# EasyEDA Pro project ProPrj_交通灯-升级款.epro

# Schematic Schematic2
Board Name: Board2; Create Date: 2025-10-13; Page Name: P1; Project Name: 交通灯-sell; Schematic Name: Schematic2; Update Date: 2025-10-13; Company: 嘉立创EDA; Page Size: A4; Version: V1.0
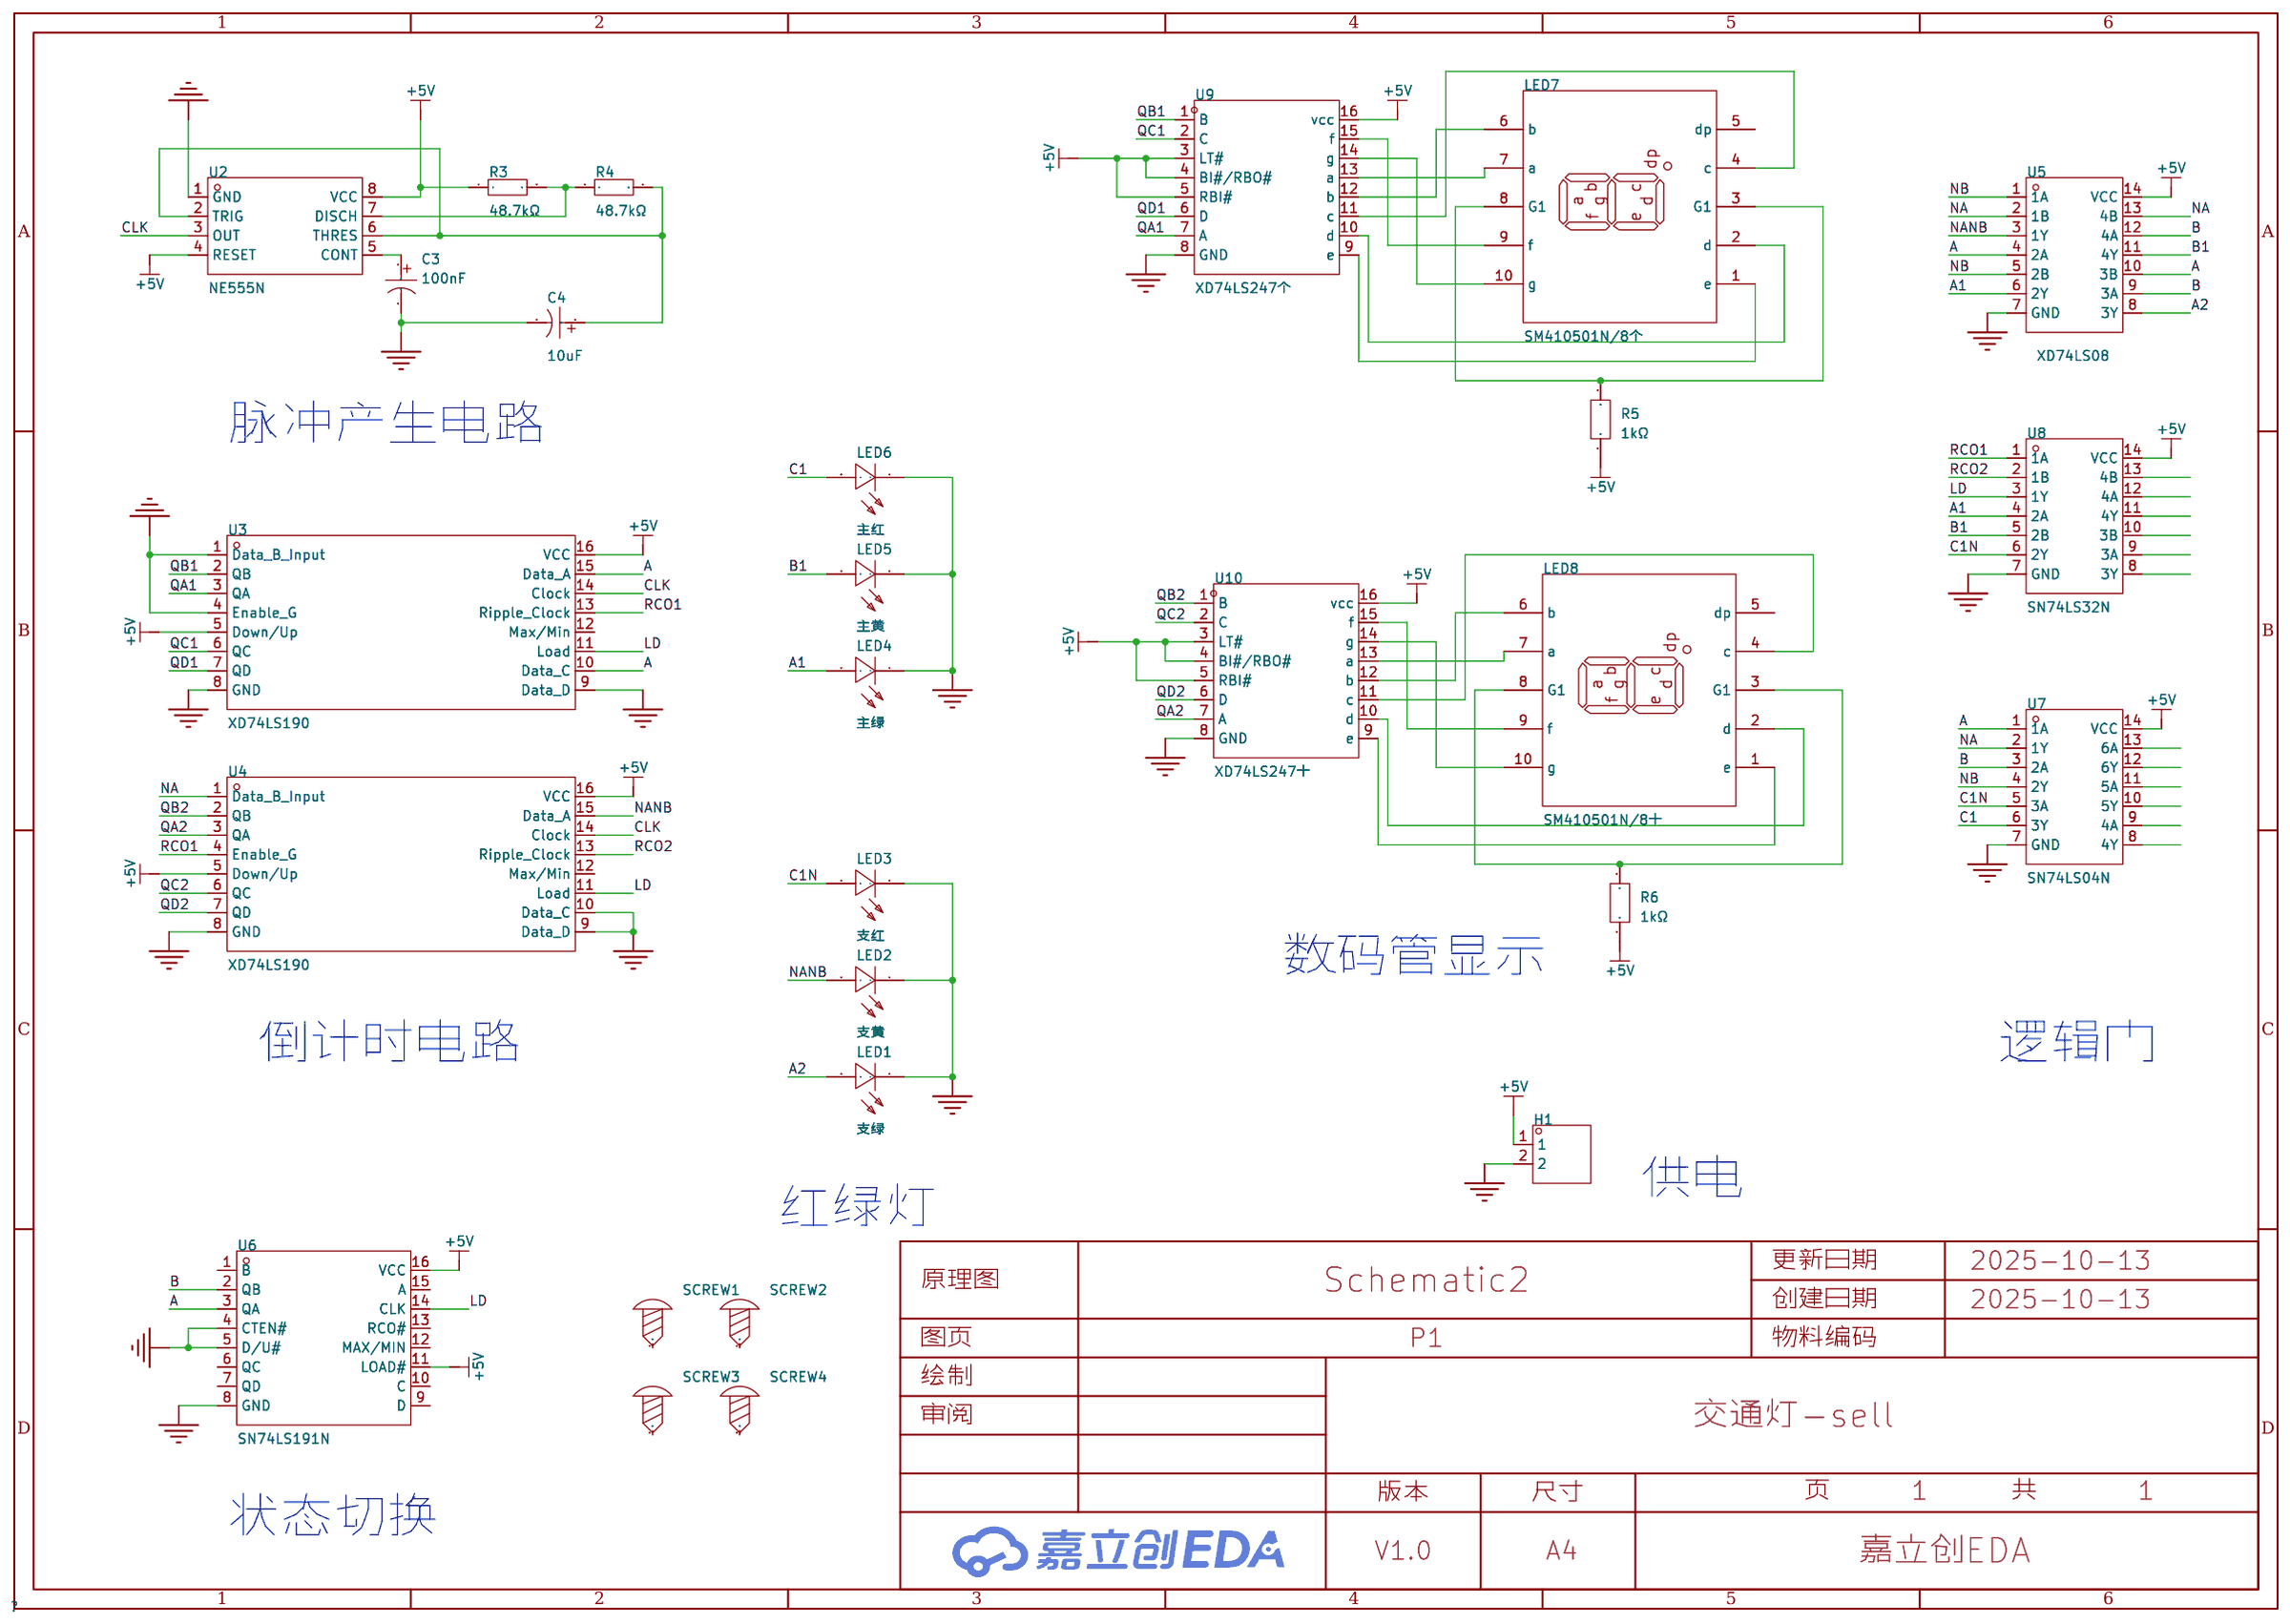
[diagram p0: schematic sheet]

## Parts
C3  100nF  [CAP-TH_BD4.0-P1.50-D0.8-FD]
C4  10uF  [CAP-TH_BD5.0-P2.00-D0.8-FD]
H1  -  [HDR-TH_2P-P2.54-V-M-1]
LED1  支绿  [LED-TH_BD3.9-P2.54-RD]
LED2  支黄  [LED-TH_BD3.9-P2.54-RD]
LED3  支红  [LED-TH_BD3.9-P2.54-RD]
LED4  主绿  [LED-TH_BD3.9-P2.54-RD]
LED5  主黄  [LED-TH_BD3.9-P2.54-RD]
LED6  主红  [LED-TH_BD3.9-P2.54-RD]
LED7  SM410501N/8个  [LED-SEG-TH_10P-L12.7-W19.0-P2.54-S15.24-BL]
LED8  SM410501N/8十  [LED-SEG-TH_10P-L12.7-W19.0-P2.54-S15.24-BL]
R3  48.7kΩ  [RES-TH_BD2.4-L6.3-P10.30-D0.6]
R4  48.7kΩ  [RES-TH_BD2.4-L6.3-P10.30-D0.6]
R5  1kΩ  [RES-TH_BD2.3-L6.5-P10.50-D0.5]
R6  1kΩ  [RES-TH_BD2.3-L6.5-P10.50-D0.5]
SCREW1  -  [M3螺丝]
SCREW2  -  [M3螺丝]
SCREW3  -  [M3螺丝]
SCREW4  -  [M3螺丝]
U2  NE555N  [DIP-8_L9.8-W6.6-P2.54-LS7.6-BL]
U3  XD74LS190  [DIP-16_L20.0-W6.4-P2.54-LS7.6-BL]
U4  XD74LS190  [DIP-16_L20.0-W6.4-P2.54-LS7.6-BL]
U5  XD74LS08  [DIP-14_L19.4-W6.4-P2.54-LS7.6-BL]
U6  SN74LS191N  [PDIP-16_L19.3-W6.4-P2.54-LS7.94-BL]
U7  SN74LS04N  [DIP-14_L19.1-W6.4-P2.54-LS7.6-BL]
U8  SN74LS32N  [DIP-14_L19.1-W6.4-P2.54-LS7.6-BL]
U9  XD74LS247个  [DIP-16_L19.3-W6.4-P2.54-LS7.6-BL]
U10  XD74LS247十  [DIP-16_L19.3-W6.4-P2.54-LS7.6-BL]

## Library data of the parts
C3 = KS104M050C07RR0VH2FP0: 容值:100nF;精度:±20%;额定电压:50V;纹波电流:1A@100kHz;等效串联电阻:-;; LCSC Part Name: 100nF ±20% 50V; Supplier Part: C45664; Manufacturer: CX(承兴); Supplier Footprint: 插件,D4xL7mm; JLCPCB Part Class: 扩展库; Datasheet: https://atta.szlcsc.com/upload/public/pdf/source/20211027/7B10195EF01EB9374BE8935690E3D906.pdf; Supplier: LCSC; Tolerance: ±20%; Rated Voltage: 50V; Ripple Current: 1A@100kHz; Lead Spacing: 1.5mm; φD: 4mm; L: 7mm; Lifetime @ Temp: 1000hrs@105℃; Operating Temperature: -40℃~+105℃
C4 = ERS1HM100D11OT: 容值:10uF;精度:±20%;额定电压:50V;; LCSC Part Name: 10uF ±20% 50V; Supplier Part: C106654; Manufacturer: AISHI(艾华集团); Supplier Footprint: 插件,D5xL11mm; JLCPCB Part Class: 扩展库; Datasheet: https://atta.szlcsc.com/upload/public/pdf/source/20191015/C438940_4B8E60A742BB0AE40DDEF87A5C89089D.pdf; Supplier: LCSC; Tolerance: ±20%; Rated Voltage: 50V; Lead Spacing: 2mm; φD: 5mm; L: 11mm; Lifetime @ Temp: 5000hrs@105℃
H1 = HDR-M_2.54_1x2P: Supplier Part: C124375; Supplier Footprint: 插件
LED1-LED6 = 204-10SUGD/S400-A4-L: Supplier Part: C778892; Manufacturer: EVERLIGHT(亿光); Supplier Footprint: 插件; JLCPCB Part Class: 扩展库; Supplier: LCSC
LED7 LED8 = SM410501N/8: 数码管位数:1位;发光颜色:红色;LED极性:共阳极;数字/字母大小(英寸):0.5;; LCSC Part Name: 1位0.5英寸红色数码管 共阳极; Supplier Part: C252200; Manufacturer: ARKLED(方舟); Supplier Footprint: 插件; JLCPCB Part Class: 扩展库; Datasheet: https://atta.szlcsc.com/upload/public/pdf/source/20180821/C252200_94AC65E7CE87F7CEF0892A0B7A50B302.pdf; Supplier: LCSC; Number of Characters: 1位; Luminous Color: 红色; LED Polarity: 共阳极; Digit/Alpha Size(inch): 0.5
R3 R4 = MFR-25FBF52-48K7: 电阻类型:金属膜电阻;阻值:48.7kΩ;精度:±1%;功率:250mW;温度系数:±100ppm/℃;; LCSC Part Name: 金属膜电阻 48.7kΩ ±1% 250mW; Supplier Part: C1365709; Manufacturer: YAGEO(国巨); Supplier Footprint: 插件,D2.4xL6.3mm; JLCPCB Part Class: 扩展库; Datasheet: https://atta.szlcsc.com/upload/public/pdf/source/20201029/C911418_CEA09B7112BCFF5AE38F343DDB8D42E7.pdf; Supplier: LCSC; Type: 金属膜电阻; Tolerance: ±1%; Power(Watts): 250mW; Temperature Coefficient: ±100ppm/℃; Operating Temperature Range: -55℃~+155℃
R5 R6 = MF1/4W-1KΩ±1%T52: 电阻类型:金属膜电阻;阻值:1kΩ;精度:±1%;功率:250mW;温度系数:±200ppm/℃;; LCSC Part Name: 金属膜电阻 1kΩ ±1% 250mW; Supplier Part: C713997; Manufacturer: 华星机电; Supplier Footprint: 插件,D2.3xL6.5mm; JLCPCB Part Class: 扩展库; Datasheet: https://atta.szlcsc.com/upload/public/pdf/source/20200731/C713882_AE8EB1102749D7E4FB4FB13DC898C429.pdf; Supplier: LCSC; Type: 金属膜电阻; Tolerance: ±1%; Power(Watts): 250mW; Temperature Coefficient: ±200ppm/℃
SCREW1-SCREW4 = M3螺丝: Supplier Footprint: 插件
U2 = NE555N_C398063: LCSC Part Name: 时基集成芯片; Supplier Part: C398063; Manufacturer: HGSEMI(华冠); Supplier Footprint: DIP-8; JLCPCB Part Class: 扩展库; Datasheet: https://atta.szlcsc.com/upload/public/pdf/source/20210507/C398063_2BAEB56D23EF029756B1D4DE6D68B235.pdf; Supplier: LCSC
U3 U4 = XD74LS190: LCSC Part Name: 计数器 IC; Supplier Part: C707104; Manufacturer: XINLUDA(信路达); Supplier Footprint: DIP-16; JLCPCB Part Class: 扩展库; Datasheet: https://atta.szlcsc.com/upload/public/pdf/source/20200724/C707104_542995D84A96E0879D87E5CA2CD6E235.pdf; Supplier: LCSC
U5 = XD74LS08: 逻辑类型:-;; Supplier Part: C521139; Manufacturer: XINLUDA(信路达); Supplier Footprint: DIP-14; JLCPCB Part Class: 扩展库; Datasheet: https://atta.szlcsc.com/upload/public/pdf/source/20200619/C521139_1A49B54134F5C67771B06657CA6D9AAF.pdf; Supplier: LCSC
U6 = SN74LS191N: 工作电压:4.75V~5.25V;元件数:1;触发沿:上升沿;计数速率:25MHz;; LCSC Part Name: 25MHz 4位二进制计数器; Supplier Part: C1523316; Manufacturer: TI(德州仪器); Supplier Footprint: PDIP-16; JLCPCB Part Class: 扩展库; Datasheet: https://www.ti.com/cn/lit/gpn/sn54ls191; Supplier: LCSC; Logic Type: 二进制计数器; Direction: 向上计数器；向下计数器; Supply Voltage: 4.75V~5.25V; Number of Elements: 1; Trigger Type: 上升沿; Timing mode: 同步; Count Rate: 25MHz; Operating Temperature: 0℃~+70℃
U7 = SN74LS04N(LX): 电源电压:2V~6V;供电电流(最大值):2uA;电路数:6;最大传播延迟(tpd):14ns@6V;; Supplier Part: C22374093; Manufacturer: LX(灵星芯微); Supplier Footprint: DIP-14; JLCPCB Part Class: 扩展库; Datasheet: https://atta.szlcsc.com/upload/public/pdf/source/20240402/834FB3A59B1B710673385084ADD2A13F.pdf; Supplier: LCSC; Supply Voltage(Single): 2V~6V; Supply Current (Max): 2uA; Number of Circuits: 6; Sink Current: 5.2mA; Source Current: 5.2mA; High level range (VIH): 1.5V~4.2V; Low level range (VIL): 500mV~1.8V; High level range (VOH): 1.9V~5.9V; Low level range (VOL): 100mV~260mV; Max Propagation Delay: 14ns@6V; Series: 74LS系列; Operating Temperature: -40℃~+125℃
U8 = SN74LS32N_C22466295: Supplier Part: C22466295; Manufacturer: LX(灵星芯微); Supplier Footprint: DIP-14; JLCPCB Part Class: 扩展库; Datasheet: https://atta.szlcsc.com/upload/public/pdf/source/20240614/E0F0D1A0EAE2126389B0ECE8583863BF.pdf; Supplier: LCSC
U9 U10 = XD74LS247: BCD 到 7 段解码器/驱动器; Supplier Part: C609771; Manufacturer: XINLUDA(信路达); Supplier Footprint: DIP-16; JLCPCB Part Class: 扩展库; Datasheet: https://atta.szlcsc.com/upload/public/pdf/source/20200619/C609772_90A4531F9A683613D8102D7E5440D56B.pdf; Supplier: LCSC

## Nets
+5V: H1.1 R3.1 R5.1 R6.1 U2.4(RESET) U2.8(VCC) U3.5(Down/Up) U3.16(VCC) U4.5(Down/Up) U4.16(VCC) U5.14(VCC) U6.11(LOAD#) U6.16(VCC) U7.14(VCC) U8.14(VCC) U9.3(LT#) U9.4(BI#/RBO#) U9.5(RBI#) U9.16(vcc) U10.3(LT#) U10.4(BI#/RBO#) U10.5(RBI#) U10.16(vcc)
GND: C3.2 C4.2 H1.2 LED1.1(-) LED2.1(-) LED3.1(-) LED4.1(-) LED5.1(-) LED6.1(-) U2.1(GND) U3.1(Data B Input) U3.4(Enable G) U3.8(GND) U3.9(Data D) U4.8(GND) U4.9(Data D) U4.10(Data C) U5.7(GND) U6.4(CTEN#) U6.5(D/U#) U6.8(GND) U7.7(GND) U8.7(GND) U9.8(GND) U10.8(GND)
A: U3.10(Data C) U3.15(Data A) U5.4(2A) U5.10(3B) U6.3(QA) U7.1(1A)
A1: LED4.2(+) U5.6(2Y) U8.4(2A)
A2: LED1.2(+) U5.8(3Y)
B: U5.9(3A) U5.12(4A) U6.2(QB) U7.3(2A)
B1: LED5.2(+) U5.11(4Y) U8.5(2B)
C1: LED6.2(+) U7.6(3Y)
C1N: LED3.2(+) U7.5(3A) U8.6(2Y)
CLK: U2.3(OUT) U3.14(Clock) U4.14(Clock)
LD: U3.11(Load) U4.11(Load) U6.14(CLK) U8.3(1Y)
NA: U4.1(Data B Input) U5.2(1B) U5.13(4B) U7.2(1Y)
NANB: LED2.2(+) U4.15(Data A) U5.3(1Y)
NB: U5.1(1A) U5.5(2B) U7.4(2Y)
QA1: U3.3(QA) U9.7(A)
QA2: U4.3(QA) U10.7(A)
QB1: U3.2(QB) U9.1(B)
QB2: U4.2(QB) U10.1(B)
QC1: U3.6(QC) U9.2(C)
QC2: U4.6(QC) U10.2(C)
QD1: U3.7(QD) U9.6(D)
QD2: U4.7(QD) U10.6(D)
RCO1: U3.13(Ripple Clock) U4.4(Enable G) U8.1(1A)
RCO2: U4.13(Ripple Clock) U8.2(1B)
$1N252: C4.1 R4.2 U2.2(TRIG) U2.6(THRES)
$1N730: R3.2 R4.1 U2.7(DISCH)
$1N740: C3.1 U2.5(CONT)
$1N6367: LED7.7(a) U9.13(a)
$1N6372: LED7.6(b) U9.12(b)
$1N6378: LED7.10(g) U9.14(g)
$1N6385: LED7.9(f) U9.15(f)
$1N6412: LED7.3(G1) LED7.8(G1) R5.2
$1N6533: LED7.4(c) U9.11(c)
$1N6544: LED7.1(e) U9.9(e)
$1N6553: LED7.2(d) U9.10(d)
$1N6791: LED8.7(a) U10.13(a)
$1N6794: LED8.6(b) U10.12(b)
$1N6798: LED8.10(g) U10.14(g)
$1N6802: LED8.9(f) U10.15(f)
$1N6806: LED8.3(G1) LED8.8(G1) R6.2
$1N6815: LED8.4(c) U10.11(c)
$1N6821: LED8.1(e) U10.9(e)
$1N6825: LED8.2(d) U10.10(d)

Not connected (* = marked no-connect by the designer): LED7 5(dp); LED8 5(dp); SCREW1 1; SCREW2 1; SCREW3 1; SCREW4 1; U3 12(Max/Min); U4 12(Max/Min); U6 1(B) 6(QC) 7(QD) 9(D) 10(C) 12(MAX/MIN) 13(RCO#) 15(A); U7 8(4Y) 9(4A) 10(5Y) 11(5A) 12(6Y) 13(6A); U8 8(3Y) 9(3A) 10(3B) 11(4Y) 12(4A) 13(4B)

## Notes on the sheet
- 脉冲产生电路
- 数码管显示
- 倒计时电路
- 逻辑门
- 供电
- 红绿灯
- 状态切换

# Board PCB3
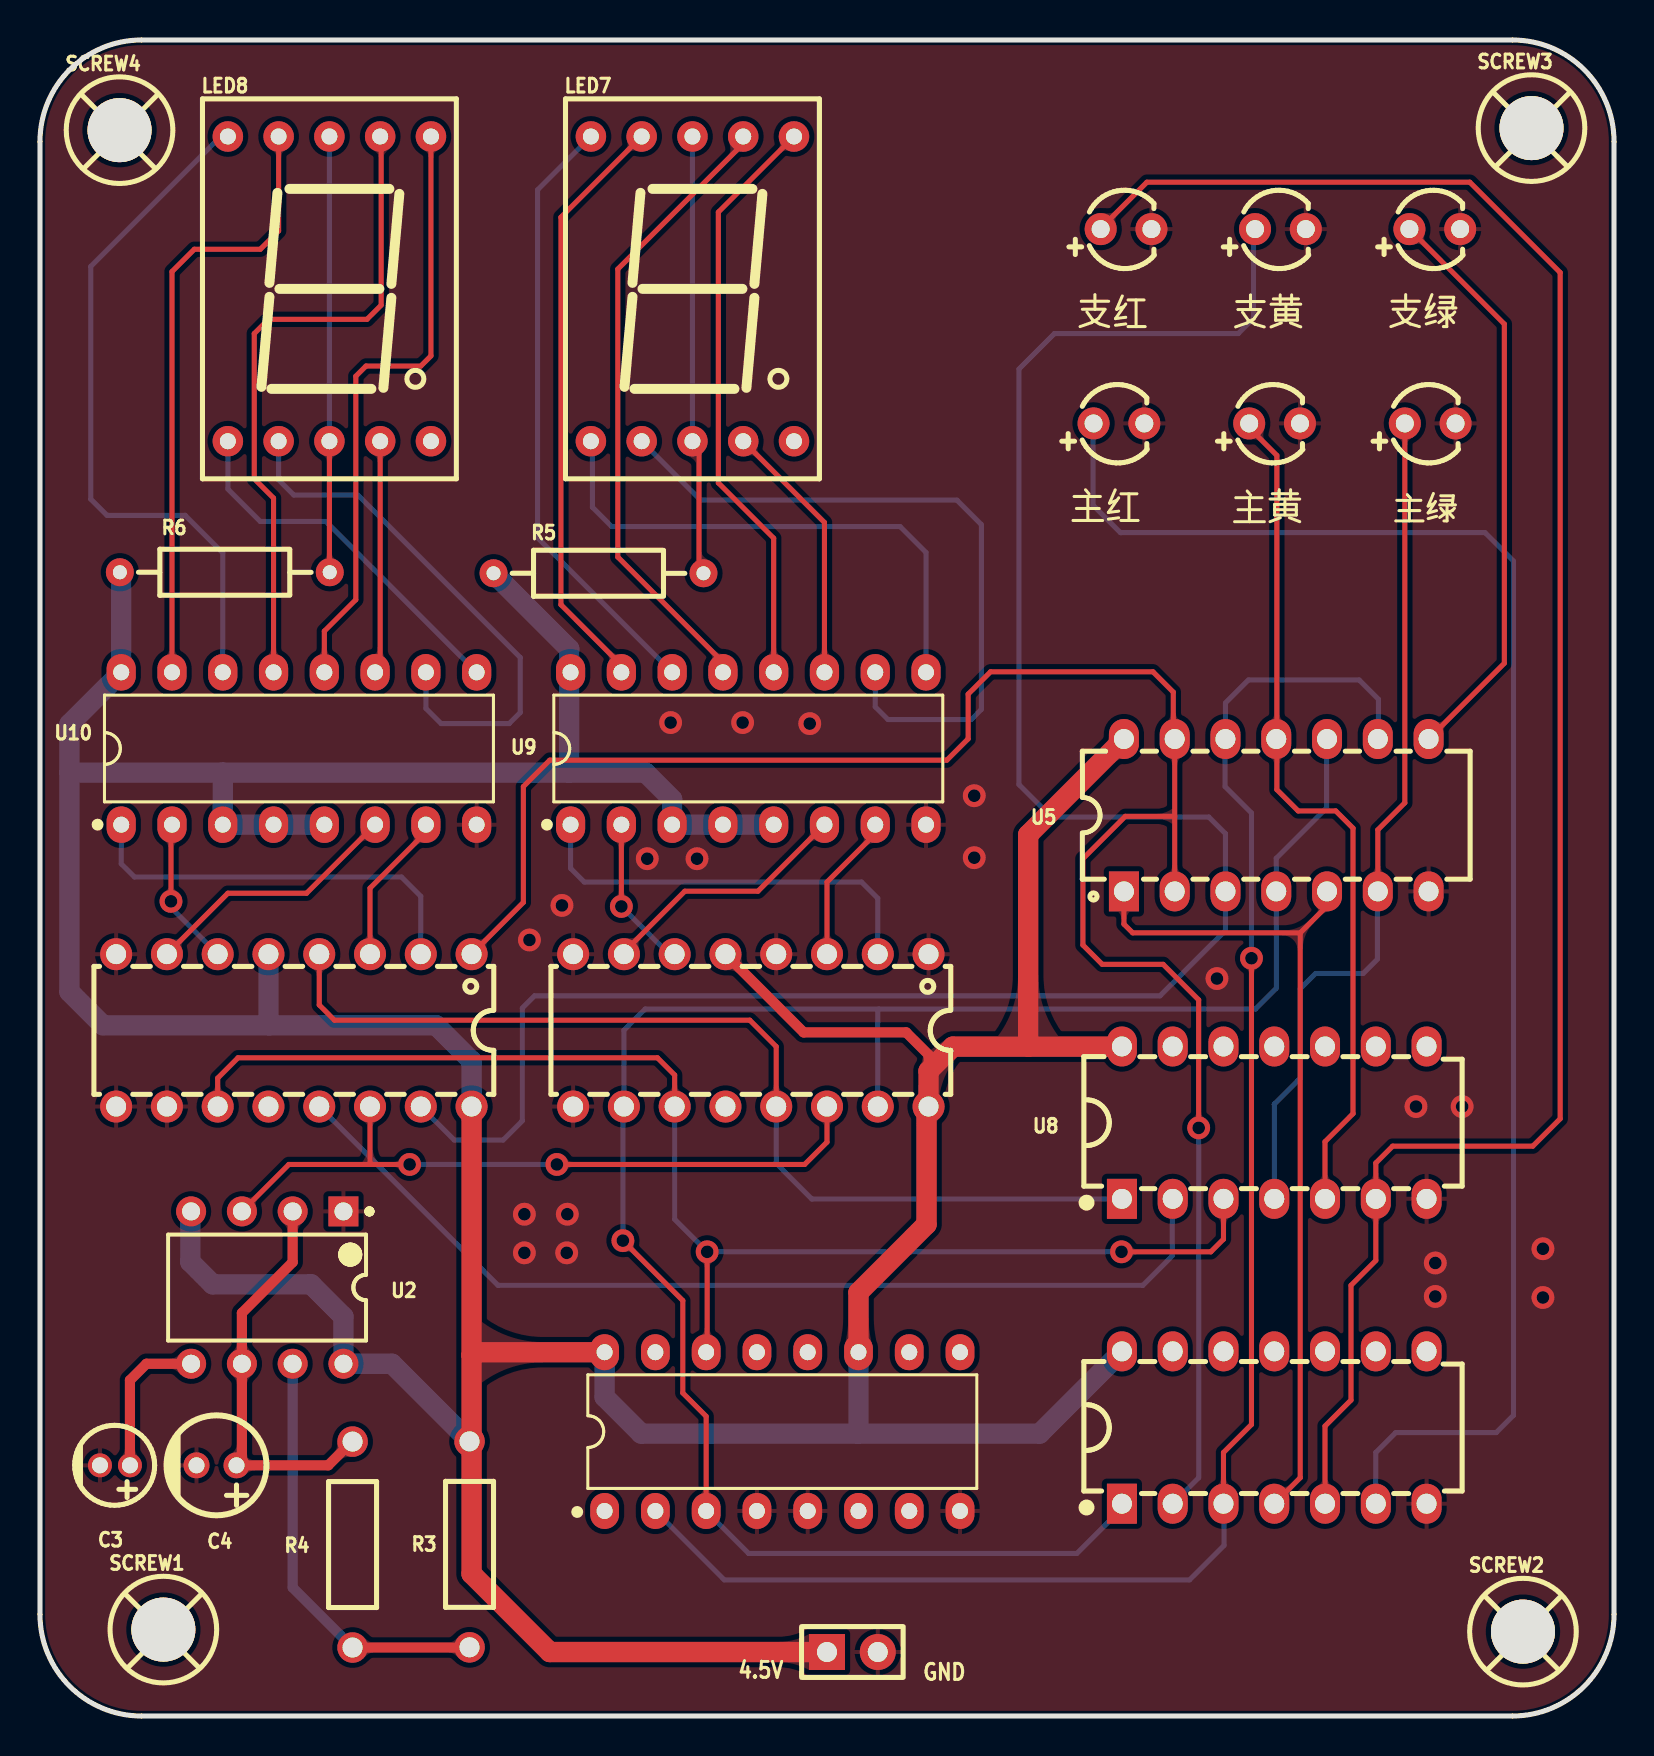
[diagram p1: board, top side]
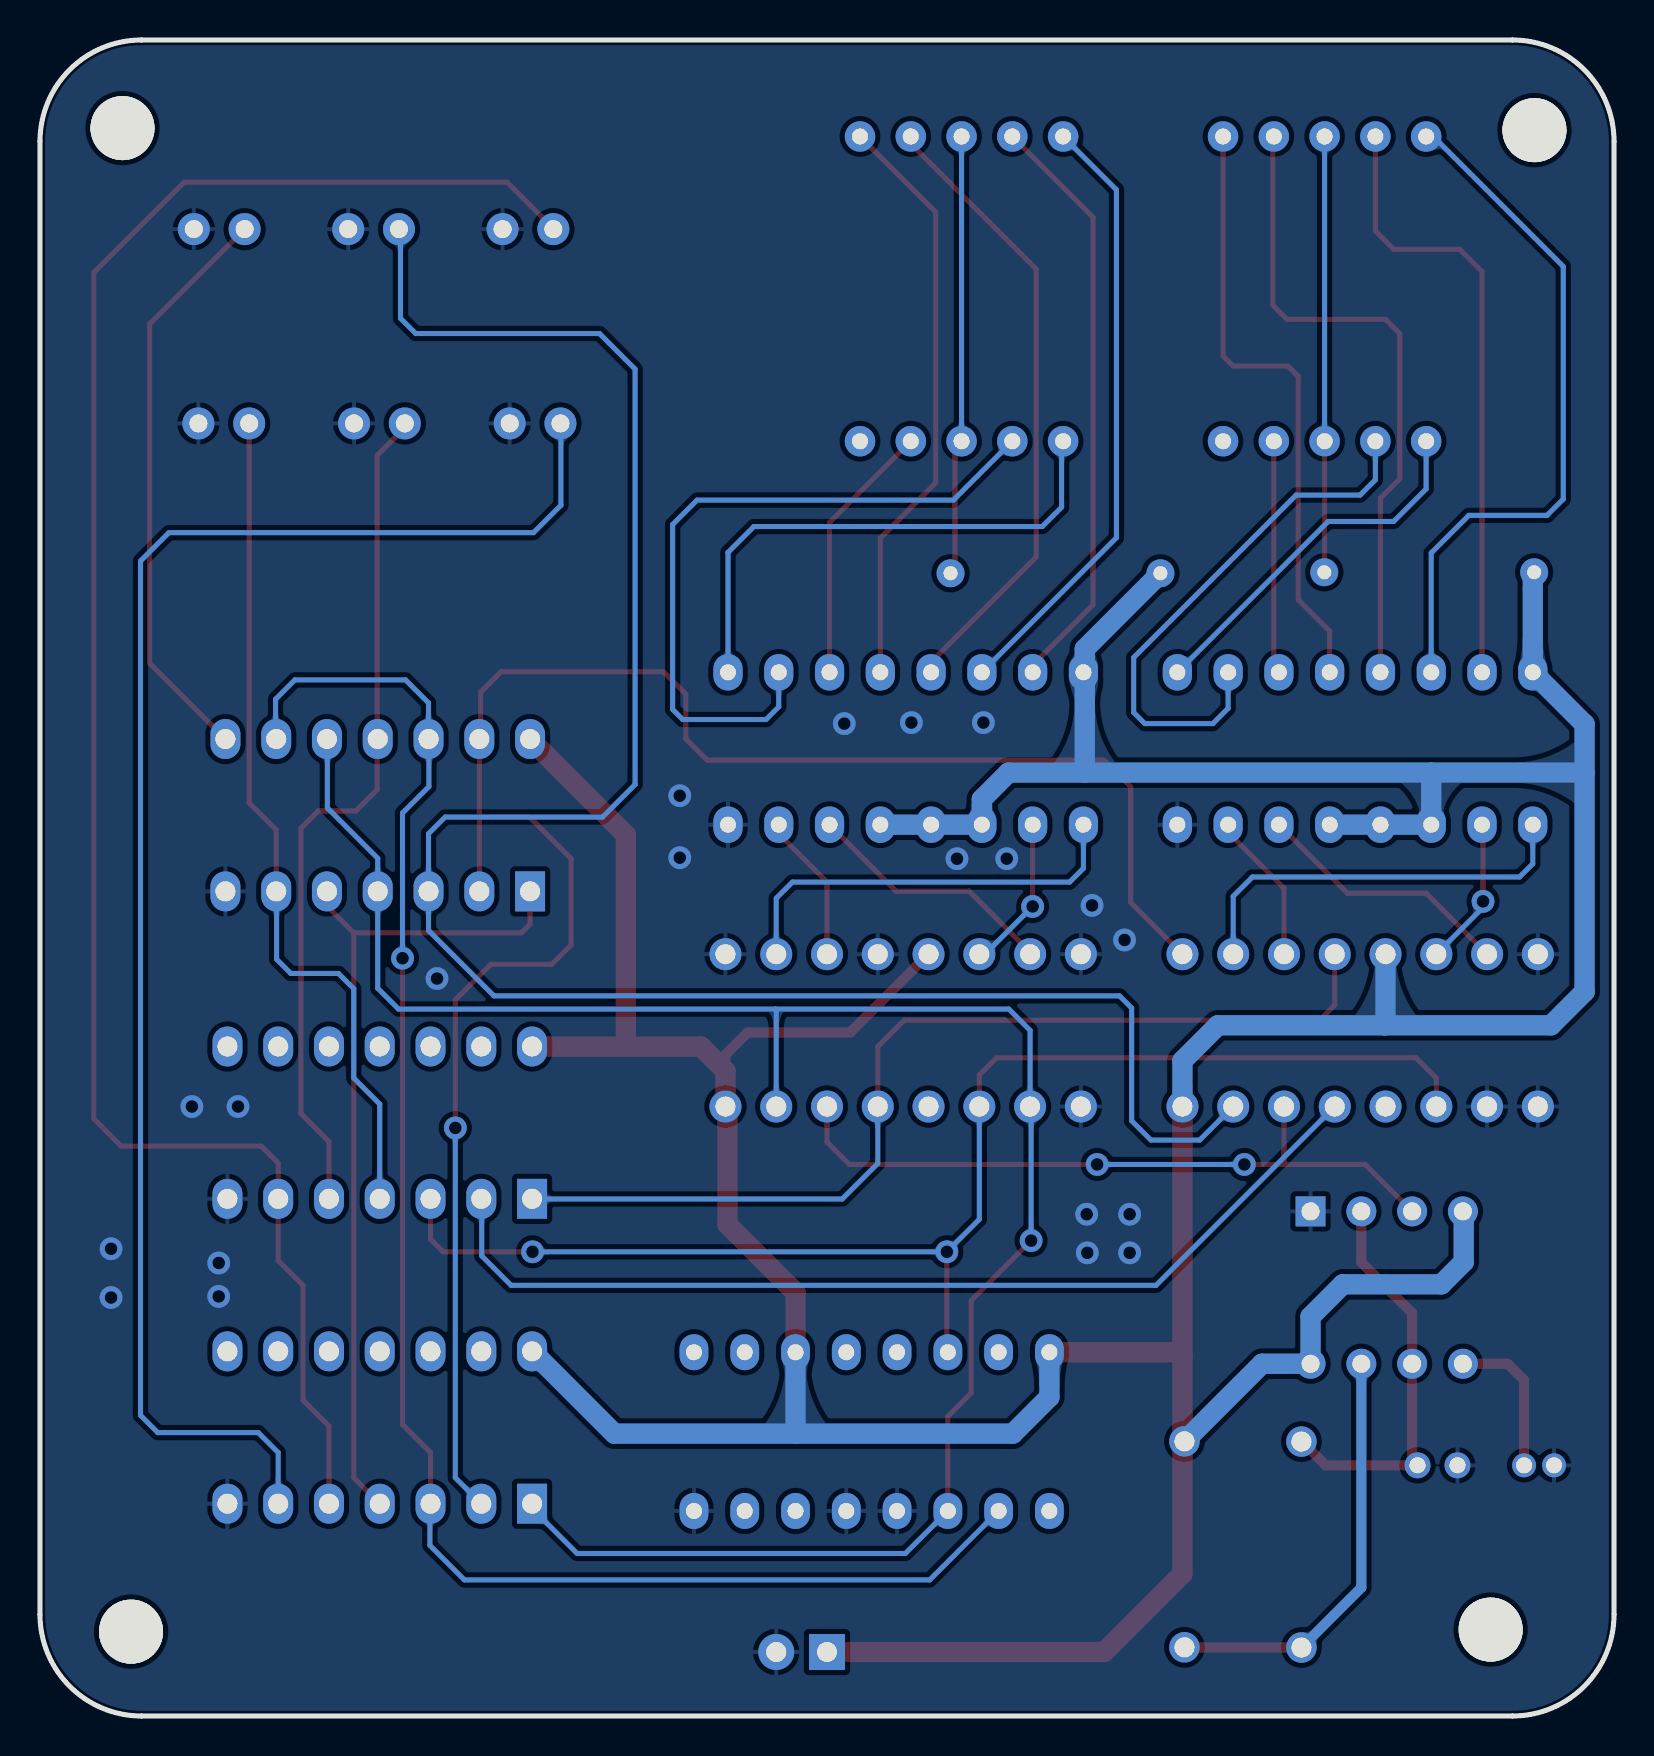
[diagram p2: board, bottom side, seen from below]

Outline 78.74 x 83.82 mm; copper layers: Top Layer, Bottom Layer. Coordinates in mm from the lower left corner of the outline.
Outline path: 0,78.74 0,5.08 arc(1.49,1.49) 5.08,0 73.66,0 arc(77.25,1.49) 78.74,5.08 78.74,78.74 arc(77.25,82.33) 73.66,83.82 5.08,83.82 arc(1.49,82.33) 0,78.74
Stack: Top Layer 0.035mm / Dielectric1 1.51mm FR4 er 4.5 / Bottom Layer 0.035mm

## Design rules (mm)
template: JLCPCB Capability(Two Layers Board)
spacing copperThickness1oz (default): track to track 0.102, other pairs 0.152 to 0.3
spacing copperThickness2oz: track to track 0.203, other pairs 0.152 to 0.3
track width copperThickness1oz (default): min 0.127, default 0.254, max 2.54
track width copperThickness2oz: min 0.203, default 0.254, max 2.54
differential pair differentialPair (default): width min 0.127, default 0.254, max 2.54; gap min 0.152, default 0.152
via viaSize (default): diameter min 0.5, default 0.61, max 10; hole min 0.3, default 0.305, max 6.3

## Placement (name value [footprint] x y rotation side)
C3  100nF  [CAP-TH_BD4.0-P1.50-D0.8-FD]  3.75 12.54 180 top
C4  10uF  [CAP-TH_BD5.0-P2.00-D0.8-FD]  8.83 12.54 180 top
H1  -  [HDR-TH_2P-P2.54-V-M-1]  40.64 3.2 0 top
LED1  支绿  [LED-TH_BD3.9-P2.54-RD]  69.77 74.36 180 top
LED2  支黄  [LED-TH_BD3.9-P2.54-RD]  62.05 74.36 180 top
LED3  支红  [LED-TH_BD3.9-P2.54-RD]  54.33 74.36 180 top
LED5  主黄  [LED-TH_BD3.9-P2.54-RD]  61.76 64.64 180 top
LED6  主红  [LED-TH_BD3.9-P2.54-RD]  53.97 64.64 180 top
LED7  SM410501N/8个  [LED-SEG-TH_10P-L12.7-W19.0-P2.54-S15.24-BL]  32.64 71.37 0 top
LED8  SM410501N/8十  [LED-SEG-TH_10P-L12.7-W19.0-P2.54-S15.24-BL]  14.48 71.37 0 top
R3  48.7kΩ  [RES-TH_BD2.4-L6.3-P10.30-D0.6]  21.49 8.58 270 top
R4  48.7kΩ  [RES-TH_BD2.4-L6.3-P10.30-D0.6]  15.64 8.57 90 top
R5  1kΩ  [RES-TH_BD2.3-L6.5-P10.50-D0.5]  27.94 57.15 0 top
R6  1kΩ  [RES-TH_BD2.3-L6.5-P10.50-D0.5]  9.25 57.2 0 top
SCREW1  -  [M3螺丝]  6.24 4.26 0 top
SCREW2  -  [M3螺丝]  74.25 4.16 0 top
SCREW3  -  [M3螺丝]  74.68 79.35 0 top
SCREW4  -  [M3螺丝]  4.04 79.25 0 top
U2  NE555N  [DIP-8_L9.8-W6.6-P2.54-LS7.6-BL]  11.37 21.43 180 top
U3  XD74LS190  [DIP-16_L20.0-W6.4-P2.54-LS7.6-BL]  35.56 34.29 180 top
U4  XD74LS190  [DIP-16_L20.0-W6.4-P2.54-LS7.6-BL]  12.7 34.29 180 top
U5  XD74LS08  [DIP-14_L19.4-W6.4-P2.54-LS7.6-BL]  61.84 45.05 0 top
U6  SN74LS191N  [PDIP-16_L19.3-W6.4-P2.54-LS7.94-BL]  37.13 14.22 0 top
U7  SN74LS04N  [DIP-14_L19.1-W6.4-P2.54-LS7.6-BL]  61.74 14.43 0 top
U8  SN74LS32N  [DIP-14_L19.1-W6.4-P2.54-LS7.6-BL]  61.74 29.67 0 top
U9  XD74LS247个  [DIP-16_L19.3-W6.4-P2.54-LS7.6-BL]  35.43 48.39 0 top
U10  XD74LS247十  [DIP-16_L19.3-W6.4-P2.54-LS7.6-BL]  12.95 48.39 0 top
主绿  主绿  [LED-TH_BD3.9-P2.54-RD]  69.54 64.64 180 top

## Footprints (pads in the part's own frame, mm; a bottom-side part is the same pattern mirrored in y, then rotated)
CAP-TH_BD4.0-P1.50-D0.8-FD
  round 1.2 hole 0.8: 1(-0.75,0) 2(0.75,0)
CAP-TH_BD5.0-P2.00-D0.8-FD
  round 1.3 hole 0.8: 1(-1,0) 2(1,0)
DIP-8_L9.8-W6.6-P2.54-LS7.6-BL
  rect 1.5x1.5 hole 0.9: 1(-3.81,-3.81)
  round 1.5 hole 0.9: 2(-1.27,-3.81) 3(1.27,-3.81) 4(3.81,-3.81) 5(3.81,3.81) 6(1.27,3.81) 7(-1.27,3.81) 8(-3.81,3.81)
DIP-14_L19.1-W6.4-P2.54-LS7.6-BL
  rect 1.5x2 hole 1: 1(-7.62,-3.81)
  oval 1.5x2 hole 1: 2(-5.08,-3.81) 3(-2.54,-3.81) 4(0,-3.81) 5(2.54,-3.81) 6(5.08,-3.81) 7(7.62,-3.81) 8(7.62,3.81) 9(5.08,3.81) 10(2.54,3.81) 11(0,3.81) 12(-2.54,3.81) 13(-5.08,3.81) 14(-7.62,3.81)
DIP-14_L19.4-W6.4-P2.54-LS7.6-BL
  rect 1.5x2 hole 1: 1(-7.62,-3.811)
  oval 1.5x2 hole 1: 2(-5.08,-3.811) 3(-2.54,-3.811) 4(0,-3.811) 5(2.54,-3.811) 6(5.08,-3.811) 7(7.62,-3.811) 8(7.62,3.811) 9(5.08,3.809) 10(2.54,3.809) 11(0,3.809) 12(-2.54,3.809) 13(-5.08,3.809) 14(-7.62,3.809)
DIP-16_L19.3-W6.4-P2.54-LS7.6-BL
  oval 1.46x1.825 hole 0.8: 1(-8.89,-3.81) 2(-6.35,-3.81) 3(-3.81,-3.81) 4(-1.27,-3.81) 5(1.27,-3.81) 6(3.81,-3.81) 7(6.35,-3.81) 8(8.89,-3.81) 9(8.89,3.81) 10(6.35,3.81) 11(3.81,3.81) 12(1.27,3.81) 13(-1.27,3.81) 14(-3.81,3.81) 15(-6.35,3.81) 16(-8.89,3.81)
DIP-16_L20.0-W6.4-P2.54-LS7.6-BL
  round 1.6 hole 1: 1(-8.89,-3.81) 2(-6.35,-3.81) 3(-3.81,-3.81) 4(-1.27,-3.81) 5(1.27,-3.81) 6(3.81,-3.81) 7(6.35,-3.81) 8(8.89,-3.81) 9(8.89,3.81) 10(6.35,3.81) 11(3.81,3.81) 12(1.27,3.81) 13(-1.27,3.81) 14(-3.81,3.81) 15(-6.35,3.81) 16(-8.89,3.81)
HDR-TH_2P-P2.54-V-M-1
  rect 1.8x1.8 hole 1: 1(-1.27,0)
  round 1.8 hole 1: 2(1.27,0)
LED-SEG-TH_10P-L12.7-W19.0-P2.54-S15.24-BL
  round 1.524 hole 0.8: 1(-5.08,-7.62) 2(-2.54,-7.62) 3(0,-7.62) 4(2.54,-7.62) 5(5.08,-7.62) 6(5.08,7.62) 7(2.54,7.62) 8(0,7.62) 9(-2.54,7.62) 10(-5.08,7.62)
LED-TH_BD3.9-P2.54-RD
  round 1.6 hole 0.9: 1(-1.27,0) 2(1.27,0)
M3螺丝
  round 3.2 hole 3.2: 1(-0.064,0.064)
PDIP-16_L19.3-W6.4-P2.54-LS7.94-BL
  oval 1.44x1.8 hole 0.8: 1(-8.89,-3.97) 2(-6.35,-3.97) 3(-3.81,-3.97) 4(-1.27,-3.97) 5(1.27,-3.97) 6(3.81,-3.97) 7(6.35,-3.97) 8(8.89,-3.97) 9(8.89,3.97) 10(6.35,3.97) 11(3.81,3.97) 12(1.27,3.97) 13(-1.27,3.97) 14(-3.81,3.97) 15(-6.35,3.97) 16(-8.89,3.97)
RES-TH_BD2.3-L6.5-P10.50-D0.5
  round 1.4 hole 0.7: 1(-5.25,0) 2(5.25,0)
RES-TH_BD2.4-L6.3-P10.30-D0.6
  round 1.524 hole 1: 1(-5.15,0) 2(5.15,0)

## Nets
As in the schematic, except:
GND: C3.2 C4.2 H1.2 LED1.1 LED2.1 LED3.1 LED5.1 LED6.1 U2.1 U3.1 U3.4 U3.8 U3.9 U4.8 U4.9 U4.10 U5.7 U6.4 U6.5 U6.8 U7.7 U8.7 U9.8 U10.8 主绿.1
A1: U5.6 U8.4 主绿.2

Pads without a net: LED7 5; LED8 5; SCREW1 1; SCREW2 1; SCREW3 1; SCREW4 1; U3 12; U4 12; U6 1 6 7 9 10 12 13 15

## Via types
v1: diameter 1.143, hole 0.635, Top Layer to Bottom Layer, 29 vias

## Routing (per net, layer and track width the routed paths; a pad name or vN(x,y) marks a point on that pad's centre or on a via; arc(x,y) is an arc through that point)
+5V: length 267.7
  Top Layer w0.508: U3.5 38.2,34.19 43.33,34.19 44.45,33.07 44.45,32.26
  Top Layer w1.016: U8.14 54.12,33.48 49.43,33.48 ; U5.14 49.43,44.07 49.43,33.48 ; U4.16 21.59,18.05 ; 21.59,18.05 21.59,7.11 25.5,3.2 H1.1 ; 21.59,18.05 21.74,18.19 U6.16 ; 49.43,33.48 45.67,33.48 44.45,32.26 U3.16 44.35,30.38 44.35,24.59 40.94,21.18 U6.11
  Bottom Layer w1.016: U7.14 50.01,14.12 40.91,14.12 ; 26.47,47.18 30.29,47.18 31.62,45.85 U9.3 U9.5 ; 26.47,47.18 9.14,47.18 ; 26.47,47.18 26.47,53.37 R5.1 ; R6.1 3.89,57.1 ; 9.14,47.18 1.47,47.18 ; 9.14,47.18 U10.3 U10.4 U10.5 ; U4.5 11.43,34.59 11.47,34.54 ; 40.91,14.12 30.07,14.12 28.25,15.95 U6.16 ; 40.91,14.12 40.94,14.15 U6.11 ; 11.47,34.54 19.81,34.54 21.59,32.77 U4.16 ; 11.47,34.54 3.15,34.54 1.47,36.22 1.47,47.18 ; 1.47,47.18 1.47,49.61 U10.16 4.06,57.15 ; 21.49,13.74 17.61,17.62 U2.8 15.18,19.97 13.56,21.59 8.64,21.59 7.52,22.71 7.52,25.19 U2.4
GND:
  vias: v1(24.23,25.09) v1(24.23,23.16) v1(24.49,38.81) v1(26.11,40.54) v1(26.35,23.16) v1(26.38,25.09) v1(30.38,42.88) v1(31.55,49.68) v1(32.87,42.88) v1(35.15,49.68) v1(38.51,49.63) v1(46.74,46.02) v1(46.74,42.93) v1(58.88,36.88) v1(68.83,30.48) v1(69.8,22.66) v1(69.8,20.98) v1(71.14,30.48) v1(75.18,23.37) v1(75.18,20.93)
A: length 100.5
  Top Layer w0.254: v1(29.16,23.77) 32.16,20.78 32.16,16.15 33.32,14.99 U6.3
  Bottom Layer w0.254: 41.95,35.36 60.81,35.36 61.84,36.39 U5.4 61.84,42.89 64.36,45.41 64.36,48.84 U5.10 ; 41.95,35.36 30.28,35.36 29.21,34.29 U3.10 29.16,30.43 v1(29.16,23.77) ; 41.95,35.36 41.91,35.31 U3.15 ; U7.1 54.12,10.38 51.87,8.13 35.45,8.13 U6.3
A1: length 43.4
  Top Layer w0.254: 68.28,65.18 68.28,45.67 66.92,44.32 U5.6
  Bottom Layer w0.254: U5.6 66.9,41.22 66.9,37.85 66.19,37.13 63.81,37.13 63.04,36.37 63.04,31.9 61.74,30.6 U8.4
A2: length 29
  Top Layer w0.254: U5.8 73.25,52.65 73.25,69.61 LED1.2
B: length 84.4
  Top Layer w0.254: U7.3 59.2,13.18 60.6,14.58 v1(60.6,37.9)
  Bottom Layer w0.254: v1(60.6,37.9) 60.6,45.16 59.28,46.48 59.28,48.84 U5.12 59.3,50.67 60.45,51.82 65.99,51.82 66.95,50.85 66.95,48.89 U5.9 ; U7.3 59.23,10.59 59.23,8.53 57.51,6.81 34.23,6.81 U6.2
B1: length 42.7
  Top Layer w0.254: 60.27,64.64 61.87,63.04 61.87,46.33 62.94,45.26 64.82,45.26 65.68,44.4 65.68,30.12 64.28,28.72 U8.5
C1: length 79.2
  Bottom Layer w0.254: 52.71,64.61 52.68,64.58 52.68,60.55 54.05,59.18 72.29,59.18 73.71,57.76 73.71,15.04 72.85,14.17 67.82,14.17 66.82,13.18 U7.6
C1N: length 96.8
  Top Layer w0.254: U7.5 64.28,14.5 65.58,15.8 65.58,21.54 66.82,22.78 U8.6 66.82,27.66 67.67,28.5 74.68,28.5 76.05,29.87 76.05,72.19 71.53,76.71 55.37,76.71 53.04,74.37 53.04,74.01 53.06,73.99
CLK: length 35.4
  Top Layer w0.254: U3.14 39.37,28.7 38.25,27.58 v1(25.86,27.58) ; 16.51,27.58 U4.14 ; 16.51,27.58 v1(18.49,27.58) ; 16.51,27.58 12.45,27.58 U2.3
  Bottom Layer w0.254: v1(18.49,27.58) v1(25.86,27.58)
LD: length 67.7
  Top Layer w0.254: U6.14 33.38,18.24 v1(33.38,23.22) ; U3.11 31.75,32.05 30.89,32.92 9.91,32.92 8.89,31.9 U4.11 ; U8.3 59.2,23.85 58.57,23.22 v1(54.1,23.22)
  Bottom Layer w0.254: v1(54.1,23.22) v1(33.38,23.22) 31.75,24.84 U3.11
NA: length 98.5
  Top Layer w0.254: 56.76,44.99 U5.13 56.69,48.93 56.69,51.21 55.68,52.22 47.55,52.22 46.43,51.1 46.43,48.87 45.36,47.8 25.5,47.8 24.18,46.48 24.18,40.69 U4.1 ; 56.76,44.99 54.29,44.99 52.17,42.88 52.17,38.56 53.14,37.59 56.19,37.59 57.96,35.81 v1(57.96,29.41) ; 56.76,44.99 U5.2
  Bottom Layer w0.254: U7.2 57.96,11.92 v1(57.96,29.41)
NANB: length 102.4
  Bottom Layer w0.254: U4.15 20.73,28.8 23.16,28.8 24.13,29.77 24.13,35.41 24.74,36.02 56.03,36.02 59.3,39.29 U5.3 59.3,44.13 58.47,44.96 50.6,44.96 48.97,46.58 48.97,67.36 50.75,69.14 59.94,69.14 60.71,69.9 60.71,73.91 60.73,73.94
NB: length 42.4
  Top Layer w0.254: 63.04,39.17 64.38,40.51 U5.5 ; 63.04,39.17 54.66,39.17 54.22,39.6 U5.1 ; 63.04,39.17 63.04,11.92 U7.4
QA1: length 7.5
  Top Layer w0.254: U3.3 39.37,41.71 41.78,44.12 U9.7
QA2: length 7.6
  Top Layer w0.254: U10.7 19.3,44.2 16.51,41.4 U4.3
QB1: length 21
  Bottom Layer w0.254: U3.2 41.91,40.89 41.1,41.71 27.23,41.71 26.54,42.39 U9.1
QB2: length 20.5
  Bottom Layer w0.254: U10.1 4.06,42.62 4.72,41.96 18.09,41.96 19.05,41 U4.2
QC1: length 7.7
  Top Layer w0.254: U9.2 v1(29.08,40.49)
  Bottom Layer w0.254: U3.6 31.47,38.1 v1(29.08,40.49)
QC2: length 7.5
  Top Layer w0.254: U10.2 6.55,44.53 v1(6.55,40.74)
  Bottom Layer w0.254: U4.6 6.55,40.44 v1(6.55,40.74)
QD1: length 12.8
  Top Layer w0.254: U9.6 35.92,41.25 32.26,41.25 29.21,38.2 U3.7
QD2: length 13.1
  Top Layer w0.254: U10.6 13.33,41.15 9.4,41.15 U4.7
RCO1: length 50.1
  Top Layer w0.254: U4.4 13.97,35.56 14.73,34.8 35.51,34.8 36.83,33.48 U3.13
  Bottom Layer w0.254: U3.13 36.83,27.63 38.61,25.86 54.12,25.86 U8.1
RCO2: length 49.8
  Bottom Layer w0.254: U8.2 56.64,25.84 56.64,23.01 55.17,21.54 22.91,21.54 U4.13
$1N252: length 20.3
  Top Layer w0.508: 15.76,13.88 14.42,12.54 C4.1 10.1,12.81 U2.6 10.1,20.16 12.64,22.7 U2.2
$1N730: length 21.3
  Top Layer w0.508: 21.49,3.44 21.48,3.42 R4.1
  Bottom Layer w0.508: U2.7 12.64,6.42 R4.1
$1N740: length 7.7
  Top Layer w0.508: C3.1 4.5,16.79 5.33,17.62 U2.5
$1N6367: length 31.6
  Top Layer w0.254: LED7.7 35.18,78.63 28.91,72.36 28.91,57.96 34.16,52.7 34.16,52.2
$1N6372: length 29.5
  Top Layer w0.254: LED7.6 33.93,75.21 33.93,61.67 36.7,58.9 U9.12
$1N6378: length 30.7
  Bottom Layer w0.254: LED7.10 24.89,76.33 24.89,58.93 U9.14
$1N6385: length 29.7
  Top Layer w0.254: U9.15 29.08,52.56 26.06,55.58 26.06,74.96 LED7.9
$1N6412: length 22.1
  Top Layer w0.254: LED7.3 32.97,63.42 32.97,57.37 R5.2
  Bottom Layer w0.254: LED7.3 LED7.8
$1N6533: length 13.2
  Top Layer w0.254: U9.11 39.24,59.69 LED7.4
$1N6544: length 27
  Bottom Layer w0.254: LED7.1 27.63,63.68 27.63,60.45 28.6,59.49 43.03,59.49 44.32,58.19 44.32,52.2
$1N6553: length 35.5
  Bottom Layer w0.254: LED7.2 33.05,60.81 45.87,60.81 47.09,59.59 47.09,50.34 46.58,49.83 42.42,49.83 41.78,50.47 U9.10
$1N6791: length 32.7
  Top Layer w0.254: LED8.7 17.07,78.94 17.07,70.56 16.36,69.85 11.43,69.85 10.72,69.14 10.72,61.87 11.68,60.91 U10.13
$1N6794: length 30.6
  Top Layer w0.254: U10.12 14.22,54.25 15.8,55.83 15.8,67 16.31,67.51 19.05,67.51 19.56,68.02 LED8.6
$1N6798: length 34.9
  Bottom Layer w0.254: U10.14 9.14,58.17 7.26,60.05 3.35,60.05 2.54,60.86 2.54,72.49 9.04,78.99 LED8.10
$1N6802: length 30.9
  Top Layer w0.254: U10.15 6.6,72.24 7.72,73.35 11.02,73.35 11.94,74.27 LED8.9
$1N6806: length 22
  Top Layer w0.254: 14.14,57.15 14.48,57.49 LED8.3
  Bottom Layer w0.254: LED8.3 LED8.8
$1N6815: length 11.7
  Top Layer w0.254: U10.11 17.02,52.45 LED8.4
$1N6821: length 18.6
  Bottom Layer w0.254: LED8.1 9.4,61.37 11.02,59.74 14.3,59.74 U10.9
$1N6825: length 27.5
  Bottom Layer w0.254: LED8.2 11.94,61.82 12.7,61.06 15.9,61.06 24.03,52.93 24.03,50.19 23.47,49.63 20.07,49.63 19.3,50.39 U10.10

## Copper pours and planes (outline as drawn; the poured copper is in the pictures)
GND on Top Layer: -4.11,87.12 83.77,87.12 83.77,-3.56 -4.11,-3.56
GND on Bottom Layer: -2.74,85.7 80.98,85.7 80.98,-2.34 -2.74,-2.34

Small or netless copper shapes (teardrops, artwork), in the pictures only: 95 on Top Layer, 84 on Bottom Layer

## Text on the board
Top Silkscreen Layer: 4.5V | GND | 主红 | 支红 | 主黄 | 支黄 | 支绿
